# EAGLE design Max2_PWR_CPU (EAGLE 6.6.0)
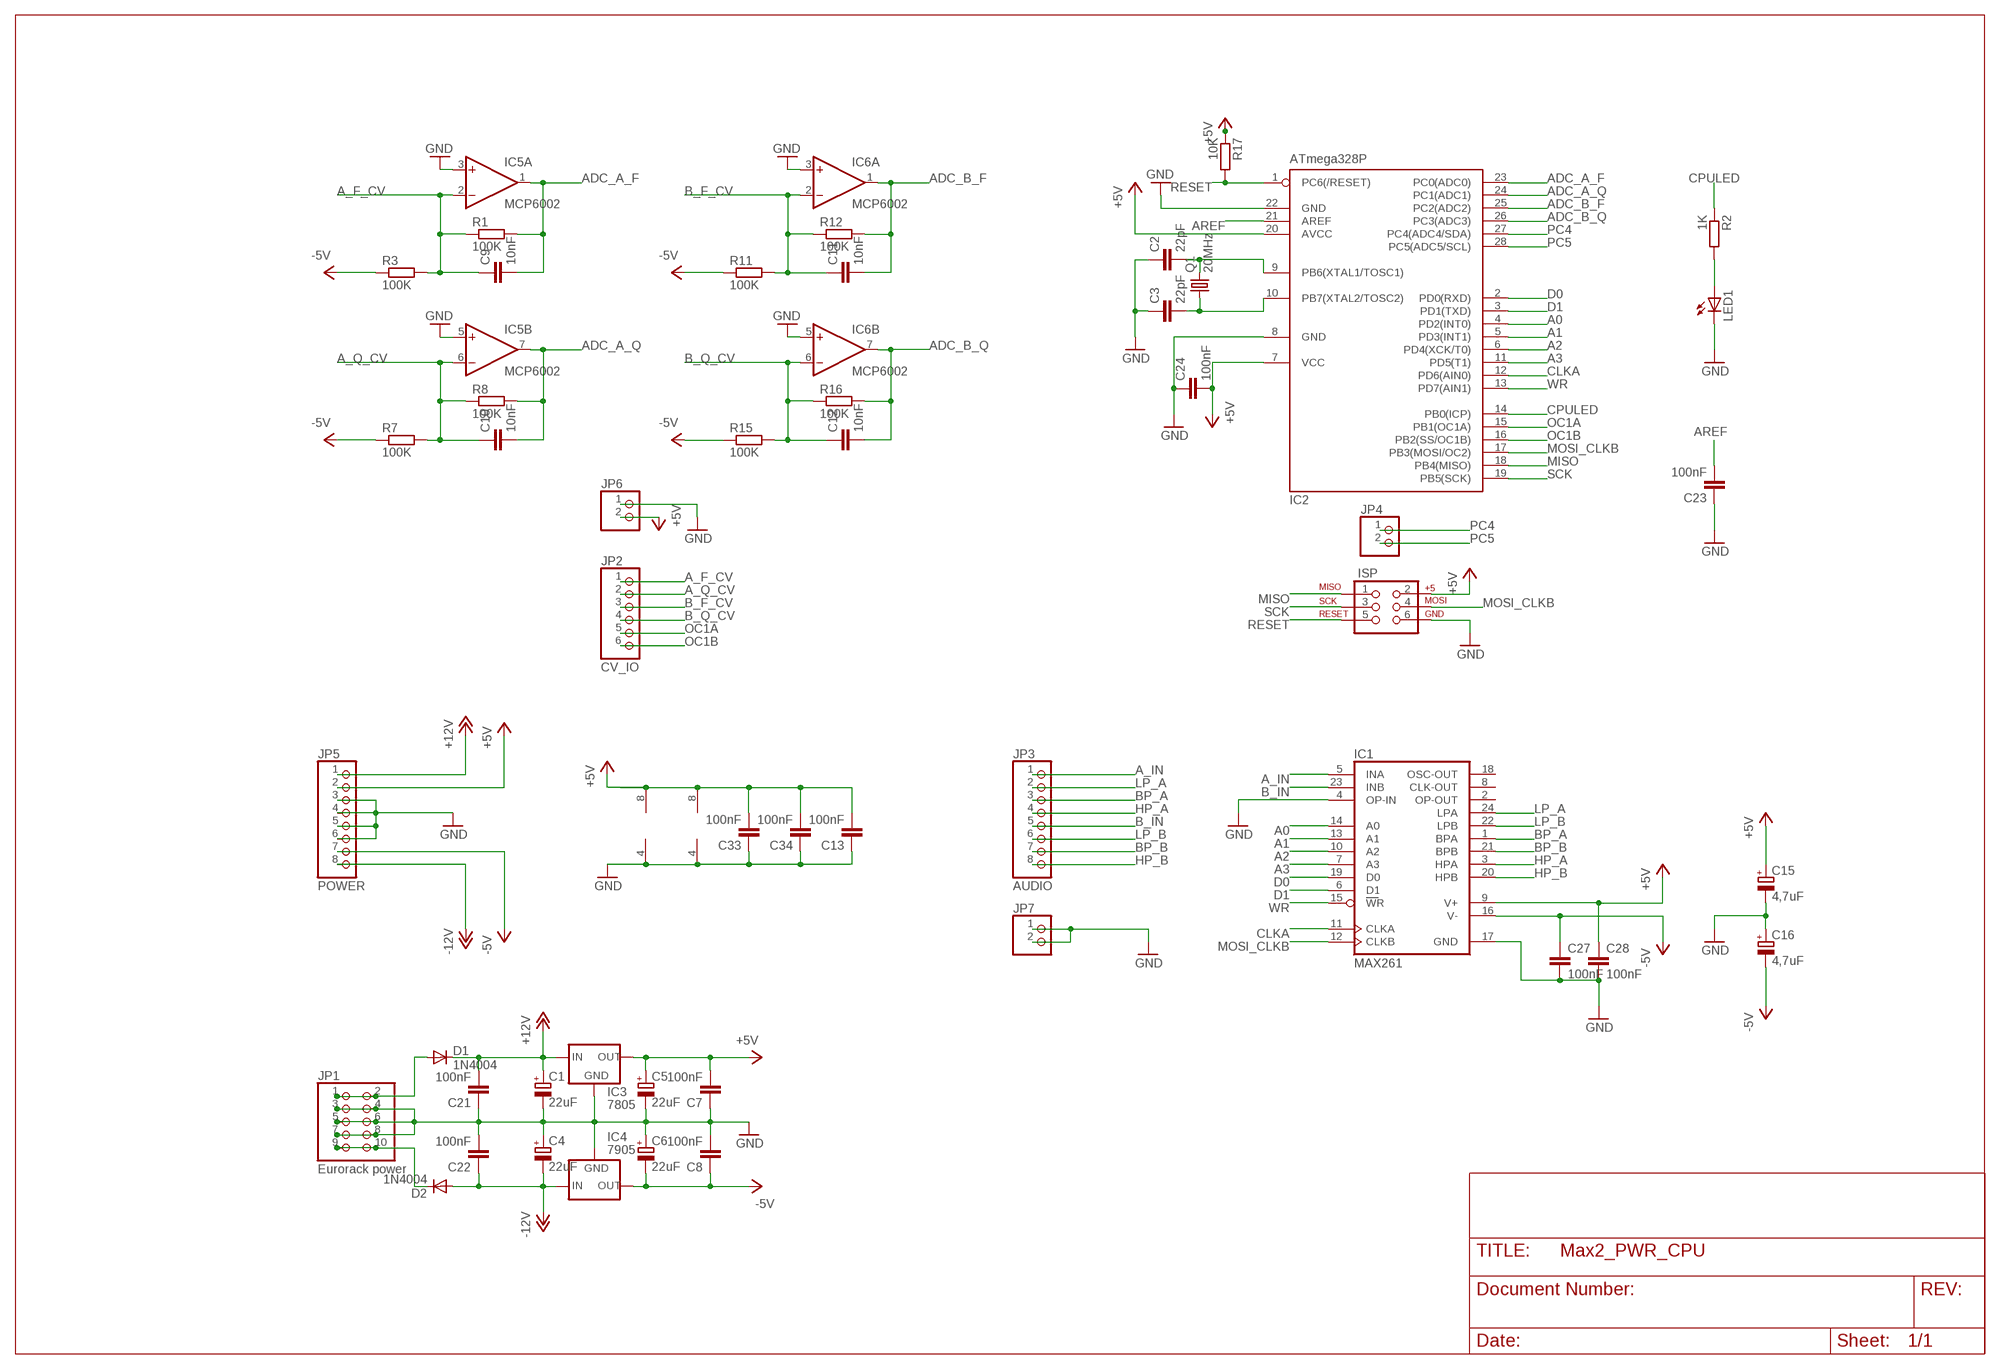
[diagram p0: schematic, sheet 1]

## Parts
C1  22uF  CPOL-EUE2.5-7  [E2,5-7]
C2  22pF  C-EU025-025X050  [C025-025X050]
C3  22pF  C-EU025-025X050  [C025-025X050]
C4  22uF  CPOL-EUE2.5-7  [E2,5-7]
C5  22uF  CPOL-EUE2.5-7  [E2,5-7]
C6  22uF  CPOL-EUE2.5-7  [E2,5-7]
C7  100nF  C-EU025-025X050  [C025-025X050]
C8  100nF  C-EU025-025X050  [C025-025X050]
C9  10nF  C-EU025-025X050  [C025-025X050]
C10  10nF  C-EU025-025X050  [C025-025X050]
C11  10nF  C-EU025-025X050  [C025-025X050]
C12  10nF  C-EU025-025X050  [C025-025X050]
C13  100nF  C-EU025-025X050  [C025-025X050]
C15  4,7uF  CPOL-EUE2.5-6  [E2,5-6]
C16  4,7uF  CPOL-EUE2.5-6  [E2,5-6]
C21  100nF  C-EU025-025X050  [C025-025X050]
C22  100nF  C-EU025-025X050  [C025-025X050]
C23  100nF  C-EU025-025X050  [C025-025X050]
C24  100nF  C-EU025-025X050  [C025-025X050]
C27  100nF  C-EU025-025X050  [C025-025X050]
C28  100nF  C-EU025-025X050  [C025-025X050]
C33  100nF  C-EU025-025X050  [C025-025X050]
C34  100nF  C-EU025-025X050  [C025-025X050]
D1  1N4004  [DO41-10]
D2  1N4004  [DO41-10]
IC1  MAX261  [DIL24-3]
IC2  ATmega328P  MEGA8-P  [DIL28-3]
IC3  7805  78XXS  [78XXS]
IC4  7905  79XXS  [79XXS]
IC5  MCP6002  MCP602P  [DIL08]
IC6  MCP6002  MCP602P  [DIL08]
ISP  AVR_SPI_PRG_6NS  [2X3-NS]
JP1  Eurorack power  PINHD-2X5  [2X05]
JP2  CV_IO  PINHD-1X6  [1X06]
JP3  AUDIO  PINHD-1X8  [1X08]
JP4  PINHD-1X2  [1X02]
JP5  POWER  PINHD-1X8  [1X08]
JP6  PINHD-1X2  [1X02]
JP7  PINHD-1X2  [1X02]
LED1  LED3MM  [LED3MM]
Q1  20MHz  CRYSTALHC49S  [HC49/S]
R1  100K  R-EU_0207/2V  [0207/2V]
R2  1K  R-EU_0207/2V  [0207/2V]
R3  100K  R-EU_0207/2V  [0207/2V]
R7  100K  R-EU_0207/2V  [0207/2V]
R8  100K  R-EU_0207/2V  [0207/2V]
R11  100K  R-EU_0207/2V  [0207/2V]
R12  100K  R-EU_0207/2V  [0207/2V]
R15  100K  R-EU_0207/2V  [0207/2V]
R16  100K  R-EU_0207/2V  [0207/2V]
R17  10K  R-EU_0207/2V  [0207/2V]

## Nets
+5V: C5.+ C7.2 C13.2 C15.+ C24.2 C28.1 C33.2 C34.2 IC1.9(V+) IC2.7(VCC) IC2.20(AVCC) IC3.OUT IC5.8(P:V+) IC6.8(P:V+) ISP.2 JP5.2 JP6.2 R17.1
+12V: C1.+ C21.2 D1.C IC3.IN JP5.1
-5V: C6.- C8.1 C16.- C27.1 IC1.16(V-) IC4.OUT JP5.7 R3.1 R7.1 R11.1 R15.1
-12V: C4.- C22.1 D2.A IC4.IN JP5.8
A0: IC1.14(A0) IC2.4(PD2(INT0))
A1: IC1.13(A1) IC2.5(PD3(INT1))
A2: IC1.10(A2) IC2.6(PD4(XCK/T0))
A3: IC1.7(A3) IC2.11(PD5(T1))
A_F_CV: C9.1 IC5.2(A:-IN) JP2.1 R1.1 R3.2
A_IN: IC1.5(INA) JP3.1
A_Q_CV: C10.1 IC5.6(B:-IN) JP2.2 R7.2 R8.1
ADC_A_F: C9.2 IC2.23(PC0(ADC0)) IC5.1(A:OUT) R1.2
ADC_A_Q: C10.2 IC2.24(PC1(ADC1)) IC5.7(B:OUT) R8.2
ADC_B_F: C11.2 IC2.25(PC2(ADC2)) IC6.1(A:OUT) R12.2
ADC_B_Q: C12.2 IC2.26(PC3(ADC3)) IC6.7(B:OUT) R16.2
AREF: C23.2 IC2.21(AREF)
B_F_CV: C11.1 IC6.2(A:-IN) JP2.3 R11.2 R12.1
B_IN: IC1.23(INB) JP3.5
B_Q_CV: C12.1 IC6.6(B:-IN) JP2.4 R15.2 R16.1
BP_A: IC1.1(BPA) JP3.3
BP_B: IC1.21(BPB) JP3.7
CLKA: IC1.11(CLKA) IC2.12(PD6(AIN0))
CPULED: IC2.14(PB0(ICP)) R2.1
D0: IC1.19(D0) IC2.2(PD0(RXD))
D1: IC1.6(D1) IC2.3(PD1(TXD))
GND: C1.- C2.1 C3.1 C4.+ C5.- C6.+ C7.1 C8.2 C13.1 C15.- C16.+ C21.1 C22.2 C23.1 C24.1 C27.2 C28.2 C33.1 C34.1 IC1.4(OP-IN) IC1.17(GND) IC2.8(GND) IC2.22(GND) IC3.GND IC4.GND IC5.3(A:+IN) IC5.4(P:V-) IC5.5(B:+IN) IC6.3(A:+IN) IC6.4(P:V-) IC6.5(B:+IN) ISP.6 JP1.3 JP1.4 JP1.5 JP1.6 JP1.7 JP1.8 JP5.3 JP5.4 JP5.5 JP5.6 JP6.1 JP7.1 JP7.2 LED1.K(C)
HP_A: IC1.3(HPA) JP3.4
HP_B: IC1.20(HPB) JP3.8
LP_A: IC1.24(LPA) JP3.2
LP_B: IC1.22(LPB) JP3.6
MISO: IC2.18(PB4(MISO)) ISP.1
MOSI_CLKB: IC1.12(CLKB) IC2.17(PB3(MOSI/OC2)) ISP.4
N$1: C2.2 IC2.9(PB6(XTAL1/TOSC1)) Q1.2
N$2: C3.2 IC2.10(PB7(XTAL2/TOSC2)) Q1.1
N$3: LED1.A R2.2
N$4: D1.A JP1.1 JP1.2
N$7: D2.C JP1.9 JP1.10
OC1A: IC2.15(PB1(OC1A)) JP2.5
OC1B: IC2.16(PB2(SS/OC1B)) JP2.6
PC4: IC2.27(PC4(ADC4/SDA)) JP4.1
PC5: IC2.28(PC5(ADC5/SCL)) JP4.2
RESET: IC2.1(PC6(/RESET)) ISP.5 R17.2
SCK: IC2.19(PB5(SCK)) ISP.3
WR: IC1.15(WR) IC2.13(PD7(AIN1))
Unconnected: IC1.2(OP-OUT) IC1.8(CLK-OUT) IC1.18(OSC-OUT)

## Library data of the parts
C1 C4-C6 C15 C16 = rcl:CPOL-EU: POLARIZED CAPACITOR, European symbol
C2 C3 C7-C13 C21-C24 C27 C28 C33 C34 = rcl:C-EU: CAPACITOR, European symbol
D1 D2 = diode:1N4004: DIODE general purpose rectifier, 1 A
IC1 = maxim:MAX261: Switched-capacitor FILTER; MPN: MAX261BCNG+; OC_FARNELL: unknown; OC_NEWARK: 89K3470
IC2 = atmel:MEGA8-P: MICROCONTROLLER 8 Kbytes FLASH, 1 kbytes SRAM, 512 bytes EEPROM, USART, 4-channel 10 bit ADC, 2-channel 8 bit ADC Pin compatible with Atmega48, ATMega88, ATMega168 Source: avr.lbr; OC_FARNELL: unknown; OC_NEWARK: unknown
IC3 = v-reg:78XXS: VOLTAGE REGULATOR
IC4 = v-reg:79XXS: VOLTAGE REGULATOR
IC5 IC6 = linear:MCP602: Single Op Amp 2.7V to 6.0V Single Supply CMOS Source: http://ww1.microchip.com/downloads/en/DeviceDoc/21314g.pdf
ISP = SparkFun:AVR_SPI_PRG_6: AVR ISP 6 Pin This is the reduced ISP connector for AVR programming. Common on Arduino. This footprint will take up less PCB space and can be used with a 10-pin to 6-pin adapter such as SKU: BOB-08508
JP1 = pinhead:PINHD-2X5: PIN HEADER
JP2 = pinhead:PINHD-1X6: PIN HEADER
JP3 JP5 = pinhead:PINHD-1X8: PIN HEADER
JP4 JP6 JP7 = pinhead:PINHD-1X2: PIN HEADER
LED1 = led:LED: LED OSRAM: - CHIPLED LG R971, LG N971, LY N971, LG Q971, LY Q971, LO R971, LY R971 LH N974, LH R974 LS Q976, LO Q976, LY Q976 LO Q996 - Hyper CHIPLED LW Q18S LB Q993, LB Q99A, LB R99A - SideLED LS A670, LO A670, LY A670, LG A670, LP A670 LB A673, LV A673, LT A673, LW A673 LH A674 LY A675 LS A676, LA A676, LO A676, LY A676, LW A676 LS A679, LY A679, LG A679 - Hyper Micro SIDELED® LS Y876, LA Y876, LO Y876, LY Y876 LT Y87S - SmartLED LW L88C, LW L88S LB L89C, LB L89S, LG L890 LS L89K, LO L89K, LY L89K LS L896, LA L896, LO L896, LY L896 - TOPLED LS T670, LO T670, LY T670, LG T670, LP T670 LSG T670, LSP T670, LSY T670, LOP T670, LYG T670 LG T671, LOG T671, LSG T671 LB T673, LV T673, LT T673, LW T673 LH T674 LS T676, LA T676, LO T676, LY T676, LB T676, LH T676, LSB T676, LW T676 LB T67C, LV T67C, LT T67C, LS T67K, LO T67K, LY T67K, LW E67C LS E67B, LA E67B, LO E67B, LY E67B, LB E67C, LV E67C, LT E67C LW T67C LS T679, LY T679, LG T679 LS T770, LO T770, LY T770, LG T770, LP T770 LB T773, LV T773, LT T773, LW T773 LH T774 LS E675, LA E675, LY E675, LS T675 LS T776, LA T776, LO T776, LY T776, LB T776 LHGB T686 LT T68C, LB T68C - Hyper Mini TOPLED® LB M676 - Mini TOPLED Santana® LG M470 LS M47K, LO M47K, LY M47K Source: http://www.osram.convergy.de LUXEON: - LUMILED® LXK2-PW12-R00, LXK2-PW12-S00, LXK2-PW14-U00, LXK2-PW14-V00 LXK2-PM12-R00, LXK2-PM12-S00, LXK2-PM14-U00 LXK2-PE12-Q00, LXK2-PE12-R00, LXK2-PE12-S00, LXK2-PE14-T00, LXK2-PE14-U00 LXK2-PB12-K00, LXK2-PB12-L00, LXK2-PB12-M00, LXK2-PB14-N00, LXK2-PB14-P00, LXK2-PB14-Q00 LXK2-PR12-L00, LXK2-PR12-M00, LXK2-PR14-Q00, LXK2-PR14-R00 LXK2-PD12-Q00, LXK2-PD12-R00, LXK2-PD12-S00 LXK2-PH12-R00, LXK2-PH12-S00 LXK2-PL12-P00, LXK2-PL12-Q00, LXK2-PL12-R00 Source: www.luxeon.com KINGBRIGHT: KA-3528ASYC Source: www.kingbright.com
Q1 = crystal:CRYSTAL: CRYSTAL; OC_FARNELL: 1667008; OC_NEWARK: unknown
R1-R3 R7 R8 R11 R12 R15-R17 = rcl:R-EU_: RESISTOR, European symbol

## Board
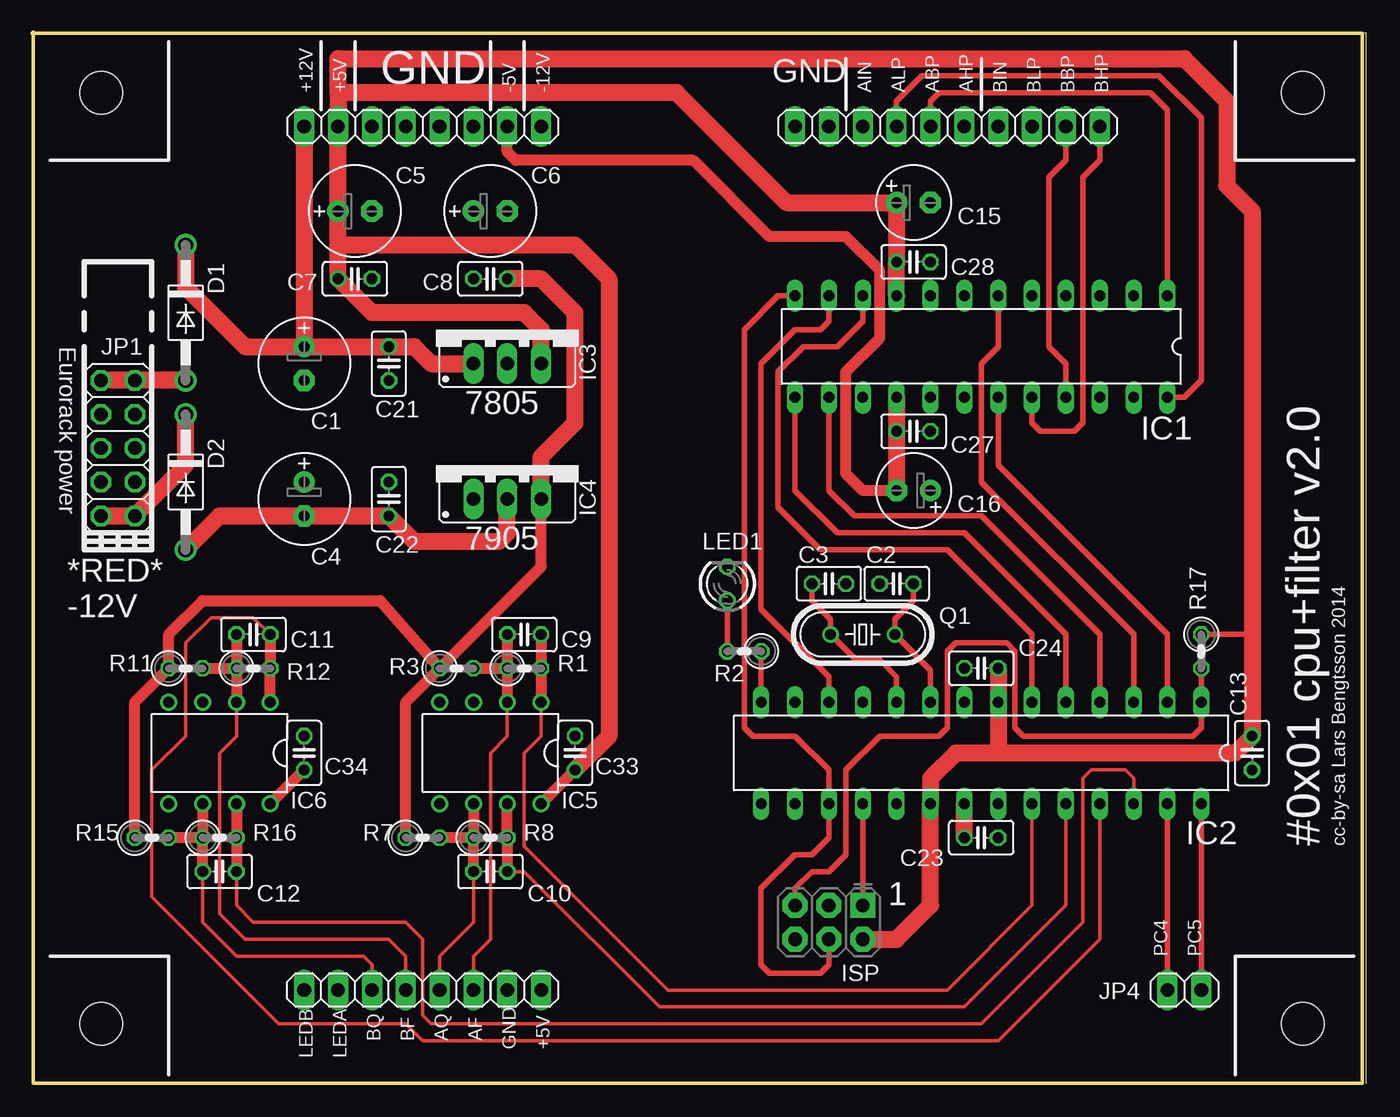
[diagram p1: board, top side]
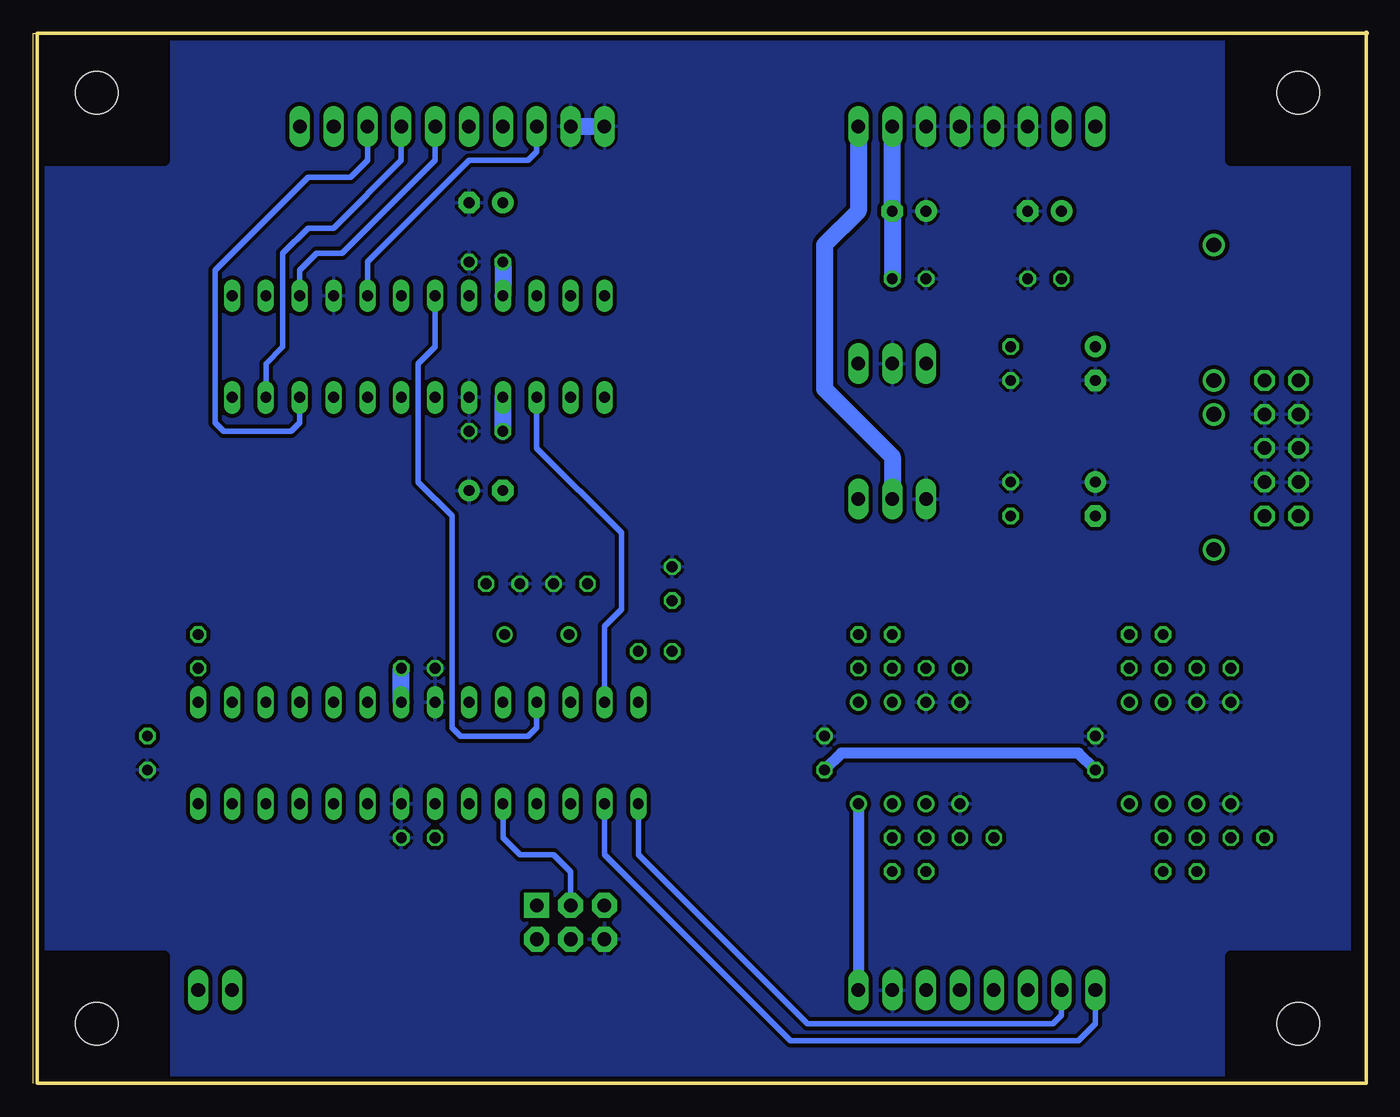
[diagram p2: board, bottom side, seen from below]

Size 100 x 78.74 mm. Coordinates in mm from the lower left corner, seen from the top.
Outline: 100,0 100,78.73 0,78.73
Outline: 0,78.73 0,78.74 99.69,78.74 99.69,0 0,0 0,78.73
Copper layers (1*16): Top 0.0356mm / dielectric 1.5011mm / Bottom 0.0356mm
Design rules "LaenPCBOrder *": minimum track width 6mil, minimum drill 13mil, track to track 6mil, track to pad 6mil, pad to pad 6mil, via to via 6mil, smd to smd 6mil, copper to edge 15mil, drill to drill 6mil, minimum pad ring 7mil, minimum via ring 7mil, stop-mask expansion 3mil, vias tented up to drill 0mil, thermal gap 10mil
Holes 3.2 mm at 5.08,74.3 5.08,4.45 95.25,4.45 95.25,74.3
bRestrict: 8 lines

### Footprints (pad centres in the part's own frame; a part is rotated, then mirrored left to right if it is on the bottom)
E2,5-7 = drill 0.813 pad 1.6: + -1.27,0 | drill 0.813 pad 1.6 octagon: - 1.27,0
C025-025X050 = drill 0.813 octagon: 1 -1.27,0; 2 1.27,0
E2,5-6 = drill 0.813 pad 1.6: + -1.27,0 | drill 0.813 pad 1.6 octagon: - 1.27,0
DO41-10 = drill 1.118: A 5.08,0; C -5.08,0
DIL24-3 = drill 0.813 long: 1 -13.97,-3.81; 2 -11.43,-3.81; 3 -8.89,-3.81; 4 -6.35,-3.81; 5 -3.81,-3.81; 6 -1.27,-3.81; 7 1.27,-3.81; 8 3.81,-3.81; 9 6.35,-3.81; 10 8.89,-3.81; 11 11.43,-3.81; 12 13.97,-3.81; 13 13.97,3.81; 14 11.43,3.81; 15 8.89,3.81; 16 6.35,3.81; 17 3.81,3.81; 18 1.27,3.81; 19 -1.27,3.81; 20 -3.81,3.81; 21 -6.35,3.81; 22 -8.89,3.81; 23 -11.43,3.81; 24 -13.97,3.81
DIL28-3 = drill 0.813 long: 1 -16.51,-3.81; 2 -13.97,-3.81; 3 -11.43,-3.81; 4 -8.89,-3.81; 5 -6.35,-3.81; 6 -3.81,-3.81; 7 -1.27,-3.81; 8 1.27,-3.81; 9 3.81,-3.81; 10 6.35,-3.81; 11 8.89,-3.81; 12 11.43,-3.81; 13 13.97,-3.81; 14 16.51,-3.81; 15 16.51,3.81; 16 13.97,3.81; 17 11.43,3.81; 18 8.89,3.81; 19 6.35,3.81; 20 3.81,3.81; 21 1.27,3.81; 22 -1.27,3.81; 23 -3.81,3.81; 24 -6.35,3.81; 25 -8.89,3.81; 26 -11.43,3.81; 27 -13.97,3.81; 28 -16.51,3.81
78XXS = drill 1.016 long: GND 0,-2.54; IN -2.54,-2.54; OUT 2.54,-2.54
79XXS = drill 1.016 long: GND -2.54,-2.54; IN 0,-2.54; OUT 2.54,-2.54
DIL08 = drill 0.813 pad 1.27: 1 -3.81,-3.81; 2 -1.27,-3.81; 3 1.27,-3.81; 4 3.81,-3.81; 5 3.81,3.81; 6 1.27,3.81; 7 -1.27,3.81; 8 -3.81,3.81
2X3-NS = drill 1.016 pad 1.88 square: 1 -2.54,-1.27 | drill 1.016 pad 1.88 octagon: 2 -2.54,1.27; 3 0,-1.27; 4 0,1.27; 5 2.54,-1.27; 6 2.54,1.27
2X05 = drill 1.016 octagon: 1 -5.08,-1.27; 2 -5.08,1.27; 3 -2.54,-1.27; 4 -2.54,1.27; 5 0,-1.27; 6 0,1.27; 7 2.54,-1.27; 8 2.54,1.27; 9 5.08,-1.27; 10 5.08,1.27
1X06 = drill 1.016 long: 1 -6.35,0; 2 -3.81,0; 3 -1.27,0; 4 1.27,0; 5 3.81,0; 6 6.35,0
1X08 = drill 1.016 long: 1 -8.89,0; 2 -6.35,0; 3 -3.81,0; 4 -1.27,0; 5 1.27,0; 6 3.81,0; 7 6.35,0; 8 8.89,0
1X02 = drill 1.016 long: 1 -1.27,0; 2 1.27,0
LED3MM = drill 0.813 octagon: A -1.27,0; K 1.27,0
HC49/S = drill 0.813: 1 -2.413,0; 2 2.413,0
0207/2V = drill 0.813 octagon: 1 -1.27,0; 2 1.27,0

### Placement (x,y rotation side)
C1  20.32,53.98 270 top
C2  64.77,37.47 0 top
C3  59.69,37.47 180 top
C4  20.32,43.81 270 top
C5  24.13,65.41 0 top
C6  34.29,65.41 0 top
C7  24.13,60.33 180 top
C8  34.29,60.33 180 top
C9  36.83,33.66 0 top
C10  34.29,15.88 0 top
C11  16.51,33.66 0 top
C12  13.97,15.88 0 top
C13  91.44,24.77 90 top
C15  66.04,66.04 0 top
C16  66.04,44.45 180 top
C21  26.67,53.98 90 top
C22  26.67,43.81 90 top
C23  71.12,18.41 180 top
C24  71.12,31.11 0 top
C27  66.04,48.9 0 top
C28  66.04,61.59 0 top
C33  40.64,24.77 270 top
C34  20.32,24.77 270 top
D1  11.43,57.78 270 top
D2  11.43,45.09 270 top
IC1  71.12,55.24 180 top
IC2  71.12,24.77 180 top
IC3  35.56,56.52 0 top
IC4  35.56,46.35 0 top
IC5  34.29,24.77 180 top
IC6  13.97,24.77 180 top
ISP  59.69,12.06 180 top
JP1  6.35,47.62 270 top
JP2  26.67,6.99 180 top
JP3  71.12,71.75 0 top
JP4  86.36,6.99 0 top
JP5  29.21,71.75 0 top
JP6  36.83,6.99 0 top
JP7  58.42,71.75 0 top
LED1  52.07,37.47 90 top
Q1  62.23,33.66 0 top
R1  36.83,31.11 0 top
R2  53.34,32.38 180 top
R3  31.75,31.11 0 top
R7  29.21,18.41 0 top
R8  34.29,18.41 0 top
R11  11.43,31.11 0 top
R12  16.51,31.11 0 top
R15  8.89,18.41 0 top
R16  13.97,18.41 0 top
R17  87.63,32.38 270 top

### Tracks (layer width: path | path; a pad name or v marks a point on that pad's centre or on a via)
+5V
  Top 0.406: R17.1 91.44,33.66
  Top 0.813: C34.2 IC6.8 | C33.2 IC5.8
  Top 1.27: IC1.9 C28.1 C15.+ 56.52,66.04 48.26,74.3 22.86,74.3 | 22.86,74.3 JP5.2 C5.+ 22.86,62.87 | 22.86,74.3 22.86,76.83 86.36,76.83 89.53,73.66 89.53,67.31 91.44,65.41 91.44,33.66 C13.2 90.17,24.77 72.39,24.77 | 72.39,24.77 IC2.7 C24.2 | 72.39,24.77 69.22,24.77 67.31,22.86 IC2.20 67.31,13.34 64.77,10.79 ISP.2 | 22.86,62.87 40.64,62.87 43.18,60.33 43.18,26.04 C33.2 | IC3.OUT 38.1,56.52 36.83,57.78 25.4,57.78 C7.2 22.86,62.87
  Bottom 0.813: C34.2 21.59,24.77 39.37,24.77 C33.2 | IC5.8 JP6.2
  Bottom 1.27: IC2.7 C24.2 | C28.1 IC1.9
+12V
  Top 1.27: C1.+ C21.2 28.57,55.24 29.84,53.98 IC3.IN | D1.C 11.43,59.69 15.88,55.24 C1.+ | JP5.1 C1.+
-5V
  Top 0.813: R15.1 7.62,28.57 R11.1 10.16,33.66 12.7,36.2 26.04,36.2 R3.1 | R7.1 27.94,28.57 R3.1 | R3.1 38.1,38.73 IC4.OUT | C16.- 62.23,44.45 60.96,45.72 60.96,53.34 63.5,55.88 63.5,60.96 60.96,63.5 55.24,63.5 49.53,69.22 36.2,69.22 35.56,69.85 JP5.7
  Top 1.27: C27.1 IC1.16 C16.- | IC4.OUT 38.1,46.99 40.64,49.53 40.64,57.78 38.1,60.33 C8.1
  Bottom 1.27: JP5.7 C6.- C8.1 | C27.1 IC1.16
-12V
  Top 1.27: D2.A 13.97,42.55 C4.- C22.1 28.57,40.64 34.92,40.64 35.56,41.27 IC4.IN
  Bottom 1.27: JP5.8 38.1,65.41 40.64,62.87 40.64,52.07 35.56,46.99 IC4.IN
A0
  Top 0.406: IC2.4 80.01,33.66 71.12,42.55 61.59,42.55 59.69,44.45 IC1.14
A1
  Top 0.406: IC2.5 77.47,33.66 69.85,41.27 60.33,41.27 57.15,44.45 IC1.13
A2
  Top 0.406: IC2.6 74.93,33.66 68.58,40.01 59.05,40.01 55.88,43.18 55.88,53.34 57.78,55.24 60.33,55.24 62.23,57.15 IC1.10
A3
  Bottom 0.406: IC1.7 69.85,55.24 71.12,53.98 71.12,45.09 68.58,42.55 68.58,26.67 67.94,26.04 62.87,26.04 62.23,26.67 IC2.11
A_F_CV
  Top 0.254: JP2.1 33.02,9.53 34.29,10.79 34.29,24.77 35.56,26.04 IC5.2
  Top 0.813: R3.2 R1.1 | C9.1 R1.1 | R1.1 IC5.2
A_IN
  Bottom 0.406: JP3.1 62.23,69.85 62.87,69.22 67.31,69.22 74.93,61.59 IC1.5
A_Q_CV
  Top 0.254: JP2.2 30.48,9.53 33.02,12.06 C10.1
  Top 0.813: C10.1 R8.1 | R8.1 R7.2 | IC5.6 R8.1
ADC_A_F
  Top 0.254: IC5.1 38.1,26.04 36.83,24.77 36.83,17.78 47.62,6.99 68.58,6.99 74.93,13.34 IC2.23
  Top 0.813: C9.2 R1.2 IC5.1
ADC_A_Q
  Top 0.254: IC2.24 77.47,13.34 69.85,5.71 46.99,5.71 36.83,15.88 C10.2
  Top 0.813: IC5.7 R8.2 C10.2
ADC_B_F
  Top 0.254: C11.2 16.51,34.92 13.34,34.92 11.43,33.02 11.43,26.04 8.89,23.5 8.89,13.97 18.41,4.45 27.94,4.45 29.21,3.17 72.39,3.17 80.01,10.79 IC2.25
  Top 0.813: C11.2 R12.2 IC6.1
ADC_B_Q
  Top 0.254: C12.2 15.24,13.34 16.51,12.06 27.94,12.06 29.21,10.79 29.21,5.08 29.84,4.45 71.12,4.45 78.74,12.06 78.74,22.86 79.38,23.5 81.92,23.5 82.55,22.86 IC2.26
  Top 0.813: IC6.7 R16.2 C12.2
AREF
  Top 1.27: C23.2 IC2.21
B_F_CV
  Top 0.254: JP2.3 27.94,9.53 26.67,10.79 15.88,10.79 13.97,12.7 13.97,24.77 15.24,26.04 IC6.2
  Top 0.813: R11.2 R12.1 | C11.1 R12.1 | R12.1 IC6.2
B_IN
  Bottom 0.406: JP3.5 72.39,69.22 77.47,64.14 79.38,64.14 81.28,62.23 81.28,55.24 82.55,53.98 IC1.23
B_Q_CV
  Top 0.254: JP2.4 25.4,8.89 24.77,9.53 15.24,9.53 12.7,12.06 C12.1
  Top 0.813: C12.1 R16.1 | R16.1 R15.2 | IC6.6 R16.1
BP_A
  Top 0.406: JP3.3 67.31,73.66 67.94,74.3 83.82,74.3 85.09,73.03 IC1.1
BP_B
  Top 0.406: JP3.7 77.47,69.22 76.2,67.94 76.2,55.24 77.47,53.98 IC1.21
CLKA
  Top 0.406: IC2.12 59.69,30.48 54.61,35.56 54.61,53.98 57.15,56.52 59.05,56.52 59.69,57.15 IC1.11
CPULED
  Top 0.406: IC2.14 R2.1
D0
  Top 0.406: IC2.2 85.09,33.66 72.39,46.35 IC1.19
D1
  Top 0.406: IC2.3 82.55,33.66 71.12,45.09 71.12,53.98 72.39,55.24 IC1.6
GND
  Bottom 1.27: JP7.2 JP7.1
  pour Bottom (isolate 0.305): 1.27,78.11 1.27,0.64 99.06,0.64 99.06,78.11
HP_A
  Bottom 0.406: 69.85,70.48 JP3.4 69.85,69.22 76.83,62.23 78.74,62.23 80.01,60.96 IC1.3
HP_B
  Top 0.406: JP3.8 80.01,69.22 78.74,67.94 78.74,49.53 78.11,48.9 75.56,48.9 74.93,49.53 IC1.20
LP_A
  Top 0.406: JP3.2 64.77,73.66 66.67,75.56 84.45,75.56 87.63,72.39 87.63,52.7 86.36,51.44 IC1.24
LP_B
  Bottom 0.406: JP3.6 74.93,69.22 76.2,67.94 79.38,67.94 86.36,60.96 86.36,49.53 85.72,48.9 80.64,48.9 80.01,49.53 IC1.22
MISO
  Top 0.406: ISP.1 IC2.18
MOSI_CLKB
  Top 0.406: ISP.4 59.69,8.89 59.05,8.26 55.24,8.26 54.61,8.89 54.61,14.61 57.15,17.14 58.42,17.14 59.69,18.41 IC2.17 59.69,23.5 57.15,26.04 53.98,26.04 53.34,26.67 53.34,56.52 55.88,59.05 IC1.12
N$1
  Top 0.406: C2.2 66.04,36.2 64.64,34.8 Q1.2 67.31,30.99 IC2.9
N$2
  Top 0.406: C3.2 58.42,36.2 59.82,34.8 Q1.1 61.59,31.88 61.59,31.75 63.5,31.75 64.77,30.48 IC2.10
N$3
  Top 0.406: R2.2 LED1.A
N$4
  Top 1.27: D1.A JP1.2 JP1.1
N$7
  Top 1.27: JP1.9 JP1.10 11.43,46.35 D2.C
OC1A
  Bottom 0.406: IC2.15 54.61,17.14 41.91,4.45 23.5,4.45 22.86,5.08 JP2.5
OC1B
  Bottom 0.406: IC2.16 57.15,17.14 43.18,3.17 21.59,3.17 20.32,4.45 JP2.6
PC4
  Top 0.406: IC2.27 JP4.1
PC5
  Top 0.406: IC2.28 JP4.2
RESET
  Top 0.406: R17.2 IC2.1 87.63,26.67 87,26.04 74.3,26.04 73.66,26.67 73.66,32.38 73.03,33.02 69.22,33.02 68.58,32.38 68.58,26.67 67.94,26.04 63.5,26.04 60.96,23.5 60.96,17.14 59.69,15.88 58.42,15.88 57.15,14.61 ISP.5
SCK
  Bottom 0.406: IC2.19 64.77,18.41 63.5,17.14 60.96,17.14 59.69,15.88 ISP.3
WR
  Bottom 0.406: IC1.15 62.23,47.62 55.88,41.27 55.88,35.56 57.15,34.29 IC2.13

### Text on the board
tPlace: GND | GND | +12V | +5V | -5V | -12V | AIN | ALP | ABP | AHP | BIN | BLP | BBP | BHP | *RED* / -12V | #0x01 cpu+filter v2.0 | cc-by-sa Lars Bengtsson 2014 | 1 | PC4 | PC5 | BQ | BF | AQ | AF | GND | +5V | LEDB | LEDA